# Altium schematic sheet power_board_2.SchDoc.SchDoc
size C
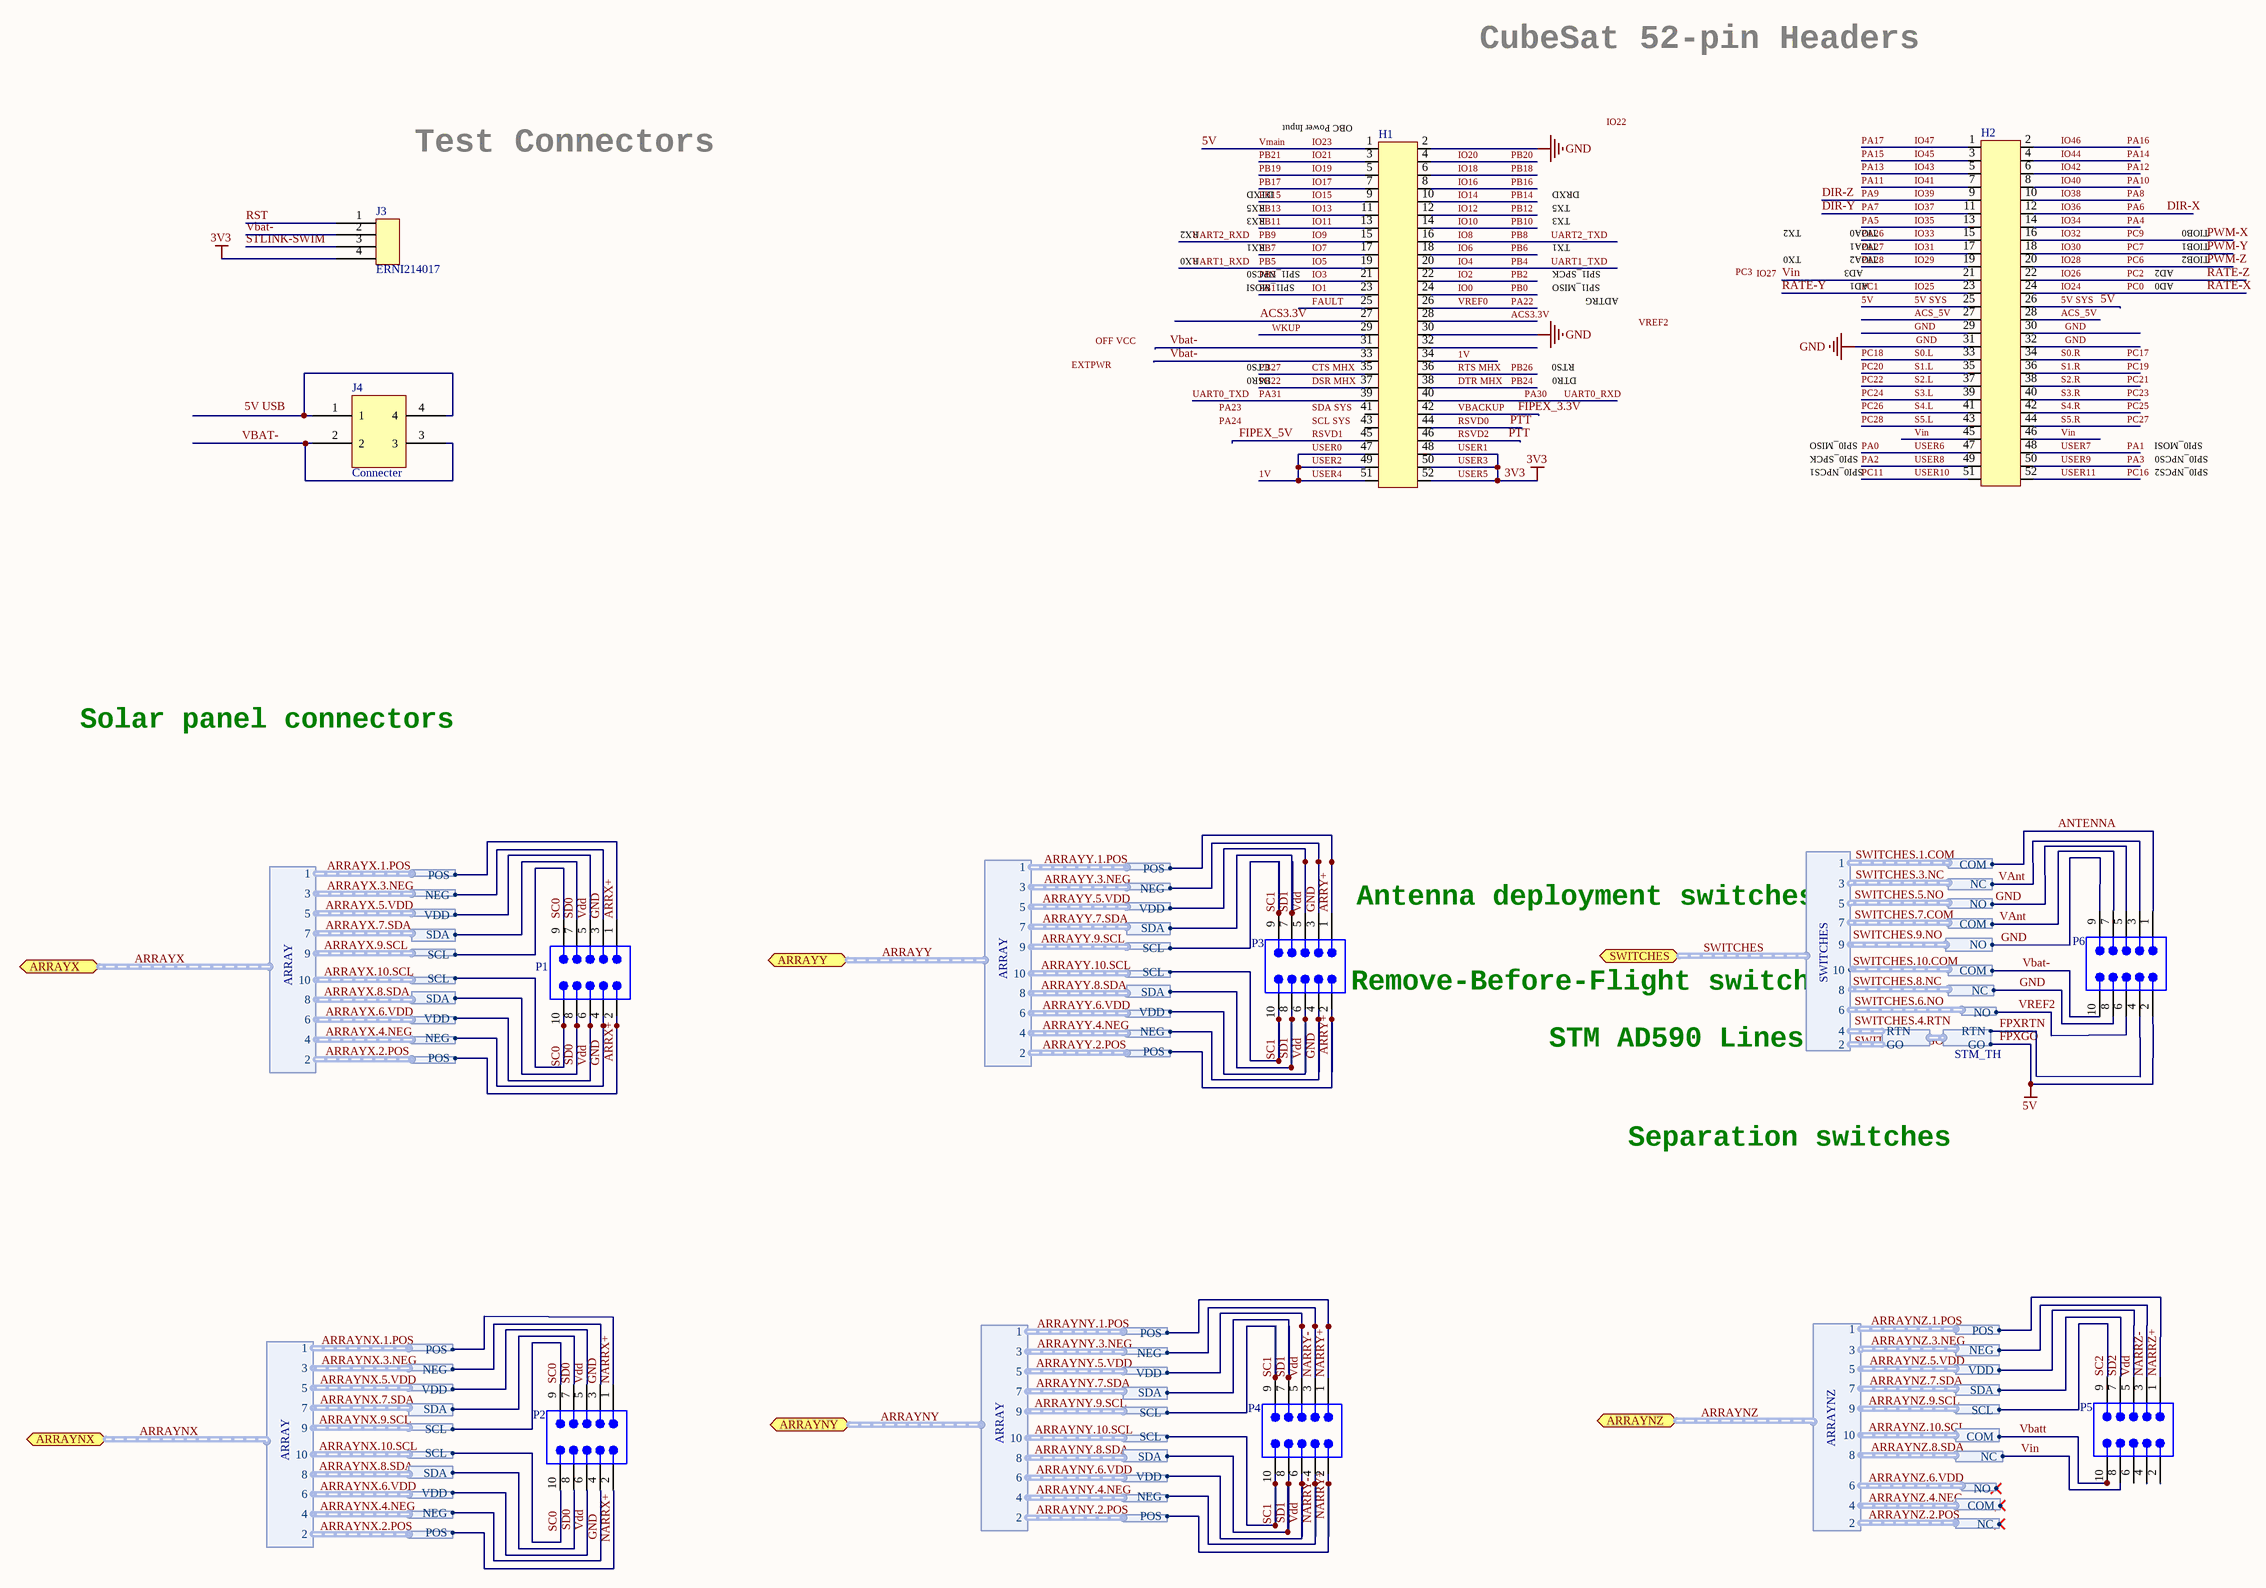
[diagram p0: power_board_2.SchDoc.SchDoc]

## Parts
H1  (no value)  [SAMTEC_ESQ_126_39_G_D]
H2  (no value)  [SAMTEC_ESQ_126_39_G_D]
J3  ERNI214017  [ERNI2014017]
J4  Connecter  [Connecter]
P1  T2M-105-01-L-D-RA  [SMTC-T2M-105-01-X-D-RA]  (value not drawn)
P2  T2M-105-01-L-D-RA  [SMTC-T2M-105-01-X-D-RA]  (value not drawn)
P3  T2M-105-01-L-D-RA  [SMTC-T2M-105-01-X-D-RA]  (value not drawn)
P4  T2M-105-01-L-D-RA  [SMTC-T2M-105-01-X-D-RA]  (value not drawn)
P5  T2M-105-01-L-D-RA  [SMTC-T2M-105-01-X-D-RA]  (value not drawn)
P6  T2M-105-01-L-D-RA  [SMTC-T2M-105-01-X-D-RA]  (value not drawn)

## Ports
ARRAYNX (harness ARRAY), ARRAYNY (harness ARRAY), ARRAYNZ (harness ARRAYNZ), ARRAYX (harness ARRAY), ARRAYY (harness ARRAY), SWITCHES (harness SWITCHES)

## Harnesses
ARRAY: 1, 10, 2, 3, 4, 5, 6, 7, 8, 9
ARRAY+: POS
ARRAY-: NEG
VDD: VDD
SDA: SDA
SCL: SCL
SEPCOM: COM
SEPNC: NC
COM: COM
NC: NC
NO: NO
SWITCHES: 10, 8, 6, 4, 2, 9, 7, 5, 3, 1
STM_TH: RTN, GO
ARRAYNZ: 10, 8, 6, 4, 2, 9, 7, 5, 3, 1

## Nets
3V3: H1.48 H1.50 H1.52 J3.4(RST)  [also labelled USER1, USER3, USER5]
5V: H1.1 H2.25 H2.26 P6.2 ; harness STM_TH.GO  [also labelled 5V SYS, FPXGO, IO23, Vmain]
GND: H1.2 H1.30 H2.29 H2.30 H2.31 H2.32 P1.3 P1.4 P2.3 P2.4 P3.3 P3.4 P6.5 P6.8 P6.9 ; harness ARRAY-.NEG, harness NO.NO, harness SEPNC.NC  [project net ARRAYNX.3.NEG.NEG]
1V: H1.34 H1.47 H1.49 H1.51  [also labelled USER0, USER2, USER4]
ACS3.3V: H1.27 H1.28
ACS_5V: H2.27 H2.28
ANTENNA: P6.1 ; harness COM.COM
ARRX+: P1.1 P1.2 ; harness ARRAY+.POS  [project net ARRAYX.1.POS.POS]
ARRY+: P3.1 P3.2 ; harness ARRAY+.POS  [project net ARRAYY.1.POS.POS]
CTS MHX: H1.35  [also labelled PB27]
DIR-X: H2.12  [also labelled IO36, PA6]
DIR-Y: H2.11  [also labelled IO37, PA7]
DIR-Z: H2.9  [also labelled IO39, PA9]
DSR MHX: H1.37  [also labelled PB22]
DTR MHX: H1.38  [also labelled PB24]
FAULT: H1.25
FIPEX_3.3V: H1.42  [also labelled VBACKUP]
FIPEX_5V: H1.45  [also labelled RSVD1]
FPXRTN: P6.4 ; harness STM_TH.RTN
IO0: H1.24  [also labelled PB0]
IO1: H1.23  [also labelled PB1]
IO2: H1.22  [also labelled PB2]
IO3: H1.21  [also labelled PB3]
IO4: H1.20  [also labelled PB4, UART1_TXD]
IO5: H1.19  [also labelled PB5, UART1_RXD]
IO6: H1.18  [also labelled PB6]
IO7: H1.17  [also labelled PB7]
IO8: H1.16  [also labelled PB8, UART2_TXD]
IO9: H1.15  [also labelled PB9, UART2_RXD]
IO10: H1.14  [also labelled PB10]
IO11: H1.13  [also labelled PB11]
IO12: H1.12  [also labelled PB12]
IO13: H1.11  [also labelled PB13]
IO14: H1.10  [also labelled PB14]
IO15: H1.9  [also labelled PB15]
IO16: H1.8  [also labelled PB16]
IO17: H1.7  [also labelled PB17]
IO18: H1.6  [also labelled PB18]
IO19: H1.5  [also labelled PB19]
IO20: H1.4  [also labelled PB20]
IO21: H1.3  [also labelled PB21]
IO24: H2.24  [also labelled PC0, RATE-X]
IO25: H2.23  [also labelled PC1, RATE-Y]
IO26: H2.22  [also labelled PC2, RATE-Z]
IO28: H2.20  [also labelled PC6, PWM-Z]
IO29: H2.19  [also labelled PA28]
IO30: H2.18  [also labelled PC7, PWM-Y]
IO31: H2.17  [also labelled PA27]
IO32: H2.16  [also labelled PC9, PWM-X]
IO33: H2.15  [also labelled PA26]
IO34: H2.14  [also labelled PA4]
IO35: H2.13  [also labelled PA5]
IO38: H2.10  [also labelled PA8]
IO40: H2.8  [also labelled PA10]
IO41: H2.7  [also labelled PA11]
IO42: H2.6  [also labelled PA12]
IO43: H2.5  [also labelled PA13]
IO44: H2.4  [also labelled PA14]
IO45: H2.3  [also labelled PA15]
IO46: H2.2  [also labelled PA16]
IO47: H2.1  [also labelled PA17]
NARRX+: P2.1 P2.2 ; harness ARRAY+.POS  [project net ARRAYNX.1.POS.POS]
NARRY+: P4.1 P4.2 ; harness ARRAY+.POS  [project net ARRAYNY.1.POS.POS]
NARRY-: P4.3 P4.4 ; harness ARRAY-.NEG  [project net ARRAYNY.3.NEG.NEG]
NARRZ+: P5.1 ; harness ARRAY+.POS  [project net ARRAYNZ.1.POS.POS]
NARRZ-: P5.3 ; harness ARRAY-.NEG  [project net ARRAYNZ.3.NEG.NEG]
PA0: H2.47  [also labelled USER6]
PA1: H2.48  [also labelled USER7]
PA2: H2.49  [also labelled USER8]
PA3: H2.50  [also labelled USER9]
PA22: H1.26  [also labelled VREF0]
PA30: H1.40  [also labelled UART0_RXD]
PA31: H1.39  [also labelled UART0_TXD]
PB26: H1.36  [also labelled RTS MHX]
PC11: H2.51  [also labelled USER10]
PC16: H2.52  [also labelled USER11]
PC17: H2.34  [also labelled S0.R]
PC18: H2.33  [also labelled S0.L]
PC19: H2.36  [also labelled S1.R]
PC20: H2.35  [also labelled S1.L]
PC21: H2.38  [also labelled S2.R]
PC22: H2.37  [also labelled S2.L]
PC23: H2.40  [also labelled S3.R]
PC24: H2.39  [also labelled S3.L]
PC25: H2.42  [also labelled S4.R]
PC26: H2.41  [also labelled S4.L]
PC27: H2.44  [also labelled S5.R]
PC28: H2.43  [also labelled S5.L]
PTT: H1.44 H1.46  [also labelled RSVD0, RSVD2]
RST: J3.1(VCC)
SC0: P1.9 P1.10 P2.9 P2.10 ; harness SCL.SCL  [project net ARRAYNX.10.SCL.SCL]
SC1: P3.9 P3.10 P4.9 P4.10 ; harness SCL.SCL  [project net ARRAYNY.10.SCL.SCL]
SC2: P5.9 ; harness SCL.SCL  [project net ARRAYNZ.9.SCL.SCL]
SD0: P1.7 P1.8 P2.7 P2.8 ; harness SDA.SDA  [project net ARRAYNX.7.SDA.SDA]
SD1: P3.7 P3.8 P4.7 P4.8 ; harness SDA.SDA  [project net ARRAYNY.7.SDA.SDA]
SD2: P5.7 ; harness SDA.SDA  [project net ARRAYNZ.7.SDA.SDA]
STLINK-SWIM: J3.3(GND)
VAnt: P6.3 P6.7 ; harness NC.NC, harness COM.COM  [project net SWITCHES.3.NC.NC]
Vbat-: H1.31 H1.33 J3.2(DATA) J4.2 J4.3 P6.10 ; harness SEPCOM.COM  [project net SWITCHES.10.COM.COM]
Vbatt: P5.10 ; harness SEPCOM.COM  [project net ARRAYNZ.10.SCL.COM]
Vdd: P1.5 P1.6 P2.5 P2.6 P3.5 P3.6 P4.5 P4.6 P5.5 ; harness VDD.VDD  [project net ARRAYNX.5.VDD.VDD]
Vin: H2.21 H2.45 H2.46 P5.8 ; harness SEPNC.NC  [project net ARRAYNZ.8.SDA.NC]
VREF2: P6.6 ; harness NO.NO
WKUP: H1.29
NetJ4_1: J4.1 J4.4

Not connected (* = marked no-connect by the designer): H1 32 41 43; P5 2 4 6

## Buses and harness runs
harness ARRAYNX = port ARRAYNX
harness ARRAYNY = port ARRAYNY
harness ARRAYNZ = port ARRAYNZ
harness ARRAYX = port ARRAYX
harness ARRAYY = port ARRAYY
harness SWITCHES = port SWITCHES

## Notes on the sheet
- CubeSat 52-pin Headers
- Test Connectors
- OBC Power Input
- RX2
- RX3
- RX5
- DTXD
- TX3
- TX5
- DRXD
- TX2
- TIOA0
- TIOB0
- RX0
- RX1
- SPI1_NPCS0
- SPI1_MOSI
- TX1
- SPI1_SPCK
- SPI1_MISO
- ADTRG
- TX0
- AD3
- AD1
- TIOA1
- TIOA2
- AD0
- AD2
- TIOB1
- TIOB2
- CTS0
- RTS0
- DSR0
- DTR0
- SPI0_MISO
- SPI0_SPCK
- SPI0_NPCS1
- SPI0_MOSI
- SPI0_NPCS0
- SPI0_NPCS2
- Solar panel connectors
- (near P3) Antenna deployment switches
- (near P3) Remove-Before-Flight switch
- STM AD590 Lines
- Separation switches
- Labels drawn without touching a wire or pin: 5V USB, EXTPWR, IO22, IO27, OFF VCC, PA23, PA24, PC3, SCL SYS, SDA SYS, SWITCHES.2.GO, SWITCHES.4.RTN, SWITCHES.6.NO, SWITCHES.9.NO, VREF2

## Library data of the parts
H1 H2 = SAMTEC_ESQ_126_39_G_D: 26X2 header
P1-P6 = CMP-1029-00150-1: High Reliability Cable Header, Through-hole, Right Angle, -55 to 125 degC, 2 mm Pitch, 10-Pin, Male, RoHS; Manufacturer: Samtec; Pitch: 2 mm; PackageVersion: V, 3/2009; ComponentLink3Description: Package Specification; ComponentLink2Description: Datasheet; Mounting Technology: Through-hole; DatasheetVersion: F-214; PartNumber: T2M-105-01-L-D-RA; PackageReference: T2M-105-01-X-D-RA; ComponentLink2URL: http://d2a072wq521u33.cloudfront.net/catalog_english//t2m.pdf; ComponentLink3URL: http://www.samtec.com/documents/webfiles/cpdf/T2M-1XX-XX-X-D-XX-XX-MKT.pdf; Temperature Range: -55 to 125 degC; ComponentLink1URL: http://www.samtec.com; RoHS: True; PackageDescription: 2mm Shrouded Terminal Strip; ComponentLink1Description: Manufacturer URL; Orientation: Right Angle; Supplier 1: Newark; Supplier Part Number 1: 79X2144
J3 = ERNI214017: Supplier 1: Mouser; Supplier Part Number 1: 305-214017
J4 = Connecter: Supplier 1: Digi-Key; Supplier Part Number 1: SAM1006-02-ND